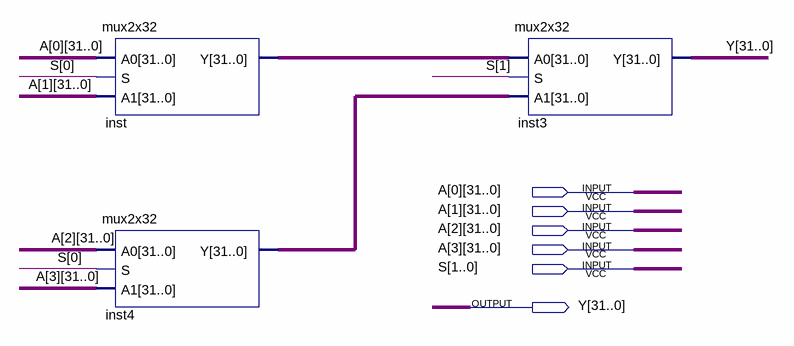
[diagram p0: schematic sheet]
// Quartus schematic mux4x32.bdf as structural Verilog: 3 symbols, 6 pins
module mux4x32 (
  input  [31:0] A_0,
  input  [31:0] A_1,
  input  [31:0] A_2,
  input  [31:0] A_3,
  input  [1:0] S,
  output [31:0] Y
);

  wire [31:0] inst4_y, inst_y;

  mux2x32 inst (.A0(A_0), .S(S[0]), .A1(A_1), .Y(inst_y));
  mux2x32 inst4 (.A0(A_2), .S(S[0]), .A1(A_3), .Y(inst4_y));
  mux2x32 inst3 (.A0(inst_y), .S(S[1]), .A1(inst4_y), .Y(Y));
endmodule
